# Altium schematic sheet Sedra.SchDoc
size A4
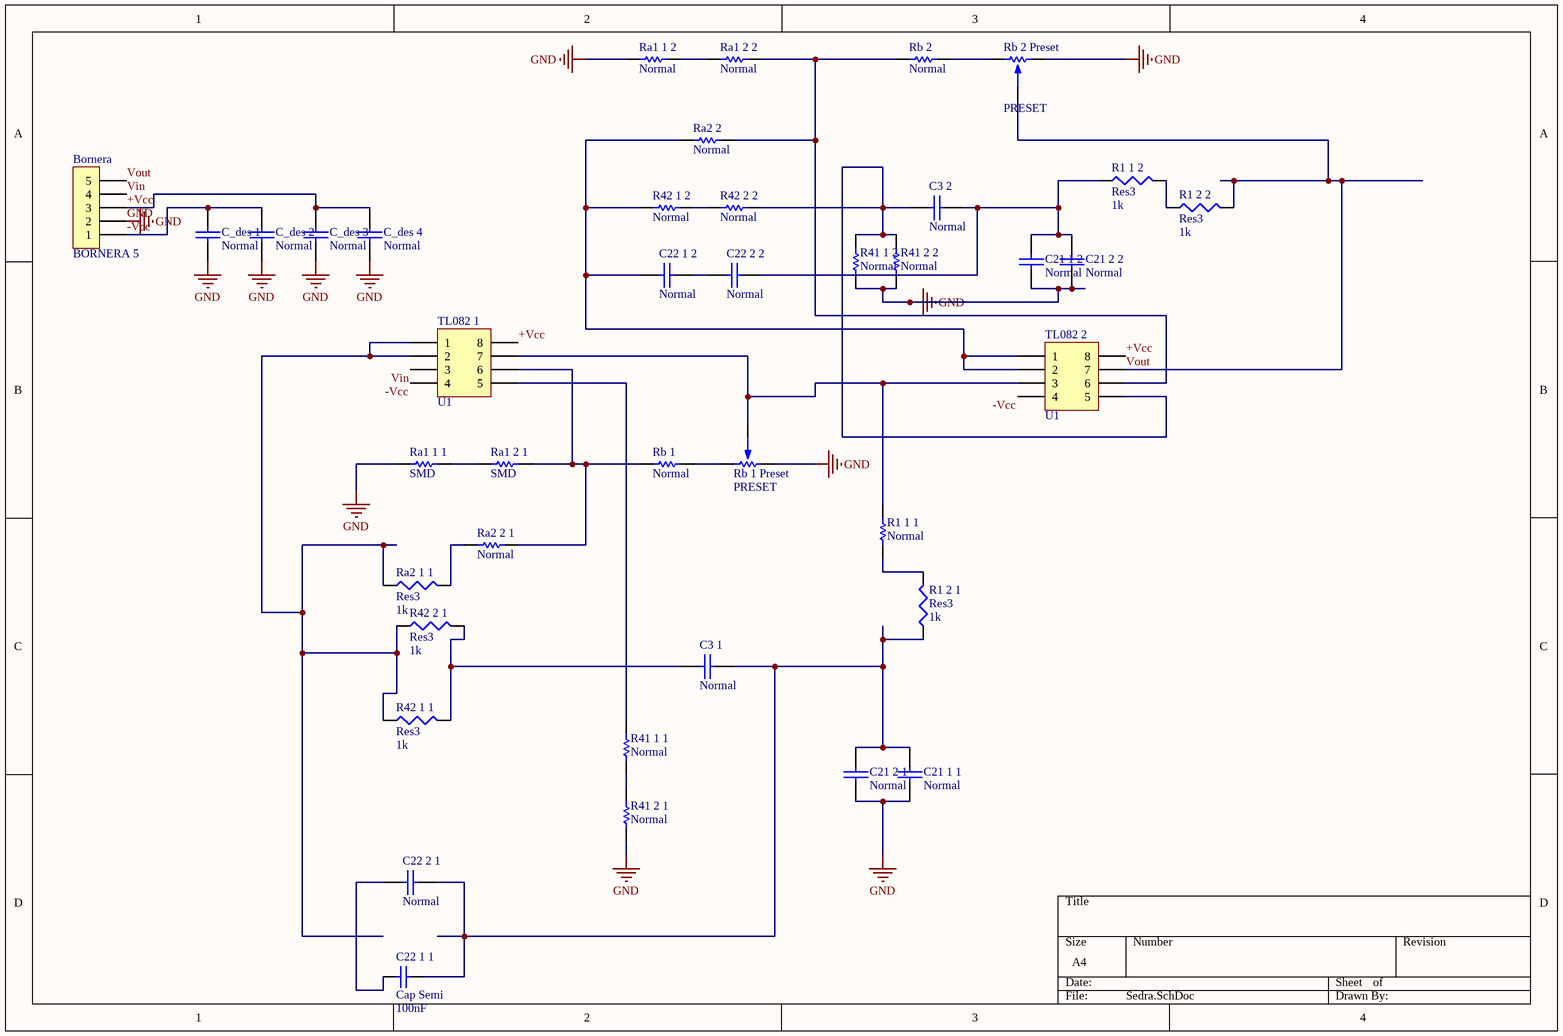
[diagram p0: Sedra.SchDoc]

## Parts
Bornera  BORNERA 5  [BORNERA5]
C3_1  Normal  [CAP200]
C3_2  Normal  [CAP200]
C21_1_1  Normal  [CAP200]
C21_1_2  Normal  [CAP200]
C21_2_1  Normal  [CAP200]
C21_2_2  Normal  [CAP200]
C22_1_1  Cap Semi  value 100nF  [C1210]
C22_1_2  Normal  [CAP200]
C22_2_1  Normal  [CAP200]
C22_2_2  Normal  [CAP200]
C_des_1  Normal  [CAP200]
C_des_2  Normal  [CAP200]
C_des_3  Normal  [CAP200]
C_des_4  Normal  [CAP200]
R1_1_1  Normal  [RES400]
R1_1_2  Res3  value 1k  [6-0805_M]
R1_2_1  Res3  value 1k  [6-0805_M]
R1_2_2  Res3  value 1k  [6-0805_M]
R41_1_1  Normal  [RES400]
R41_1_2  Normal  [RES400]
R41_2_1  Normal  [RES400]
R41_2_2  Normal  [RES400]
R42_1_1  Res3  value 1k  [6-0805_M]
R42_1_2  Normal  [RES400]
R42_2_1  Res3  value 1k  [6-0805_M]
R42_2_2  Normal  [RES400]
Ra1_1_1  SMD  [0805]
Ra1_1_2  Normal  [RES400]
Ra1_2_1  SMD  [0805]
Ra1_2_2  Normal  [RES400]
Ra2_1_1  Res3  value 1k  [6-0805_M]
Ra2_2  Normal  [RES400]
Ra2_2_1  Normal  [RES400]
Rb_1  Normal  [RES400]
Rb_1_Preset  PRESET  [PRESET V]
Rb_2  Normal  [RES400]
Rb_2_Preset  PRESET  [PRESET V]
TL082_1  U1  [DIP8]
TL082_2  U1  [DIP8]

## Nets
GND: Bornera.2 C21_1_1.1 C21_1_2.1 C21_2_1.1 C21_2_2.1 C_des_1.1 C_des_2.1 C_des_3.1 C_des_4.1 R41_1_2.1 R41_2_1.1 R41_2_2.1 Ra1_1_1.1 Ra1_1_2.1 Rb_1_Preset.3 Rb_2_Preset.1
+Vcc: Bornera.3 C_des_3.2 C_des_4.2 TL082_1.8 TL082_2.8
-Vcc: Bornera.1 C_des_1.2 C_des_2.2 TL082_1.4 TL082_2.4
Vin: Bornera.4 TL082_1.3
Vout: Bornera.5 R1_2_2.2 Rb_2_Preset.2 TL082_2.7
NetC3_1_1: C3_1.1 R42_1_1.2 R42_2_1.2
NetC3_1_2: C3_1.2 C21_1_1.2 C21_2_1.2 C22_1_1.1 C22_2_1.2 R1_2_1.1
NetC3_2_1: C3_2.1 R41_1_2.2 R41_2_2.2 R42_2_2.2 TL082_2.5
NetC3_2_2: C3_2.2 C21_1_2.2 C21_2_2.2 C22_2_2.2 R1_1_2.1
NetC22_1_1_2: C22_1_1.2 C22_2_1.1
NetC22_1_2_1: C22_1_2.1 R42_1_2.1 Ra2_2.1 TL082_2.1 TL082_2.2
NetC22_1_2_2: C22_1_2.2 C22_2_2.1
NetR1_1_1_1: R1_1_1.1 R1_2_1.2
NetR1_1_1_2: R1_1_1.2 Rb_1_Preset.2 TL082_1.7 TL082_2.3
NetR1_1_2_2: R1_1_2.2 R1_2_2.1
NetR41_1_1_1: R41_1_1.1 R41_2_1.2
NetR41_1_1_2: R41_1_1.2 TL082_1.5
NetR42_1_1_1: R42_1_1.1 R42_2_1.1 Ra2_1_1.1 TL082_1.1 TL082_1.2
NetR42_1_2_2: R42_1_2.2 R42_2_2.1
NetRa1_1_1_2: Ra1_1_1.2 Ra1_2_1.1
NetRa1_1_2_2: Ra1_1_2.2 Ra1_2_2.1
NetRa1_2_1_2: Ra1_2_1.2 Ra2_2_1.2 Rb_1.1 TL082_1.6
NetRa1_2_2_2: Ra1_2_2.2 Ra2_2.2 Rb_2.1 TL082_2.6
NetRa2_1_1_2: Ra2_1_1.2 Ra2_2_1.1
NetRb_1_2: Rb_1.2 Rb_1_Preset.1
NetRb_2_2: Rb_2.2 Rb_2_Preset.3

## Library data of the parts
C3_1 C3_2 C21_1_1 C21_1_2 C21_2_1 C21_2_2 C22_1_2 C22_2_1 C22_2_2 C_des_1-C_des_4 = CAP
C22_1_1 = Cap Semi: Capacitor (Semiconductor SIM Model); Published: 8-Jun-2000; LatestRevisionDate: 29-May-2009; LatestRevisionNote: IPC-7351 Footprint Added.; PackageReference: C1206; Publisher: Altium Limited; PackageDescription: Chip Capacitor
R1_1_1 R41_1_1 R41_1_2 R41_2_1 R41_2_2 R42_1_2 R42_2_2 Ra1_1_1 Ra1_1_2 Ra1_2_1 Ra1_2_2 Ra2_2 Ra2_2_1 Rb_1 Rb_2 = RES
R1_1_2 R1_2_1 R1_2_2 R42_1_1 R42_2_1 Ra2_1_1 = Res3: Resistor; Published: 8-Jun-2000; LatestRevisionDate: 29-May-2009; LatestRevisionNote: IPC-7351 Footprint Added.; PackageReference: J1-0603; Publisher: Altium Limited; PackageDescription: Chip Resistor
TL082_1 TL082_2 = IC_DIP8